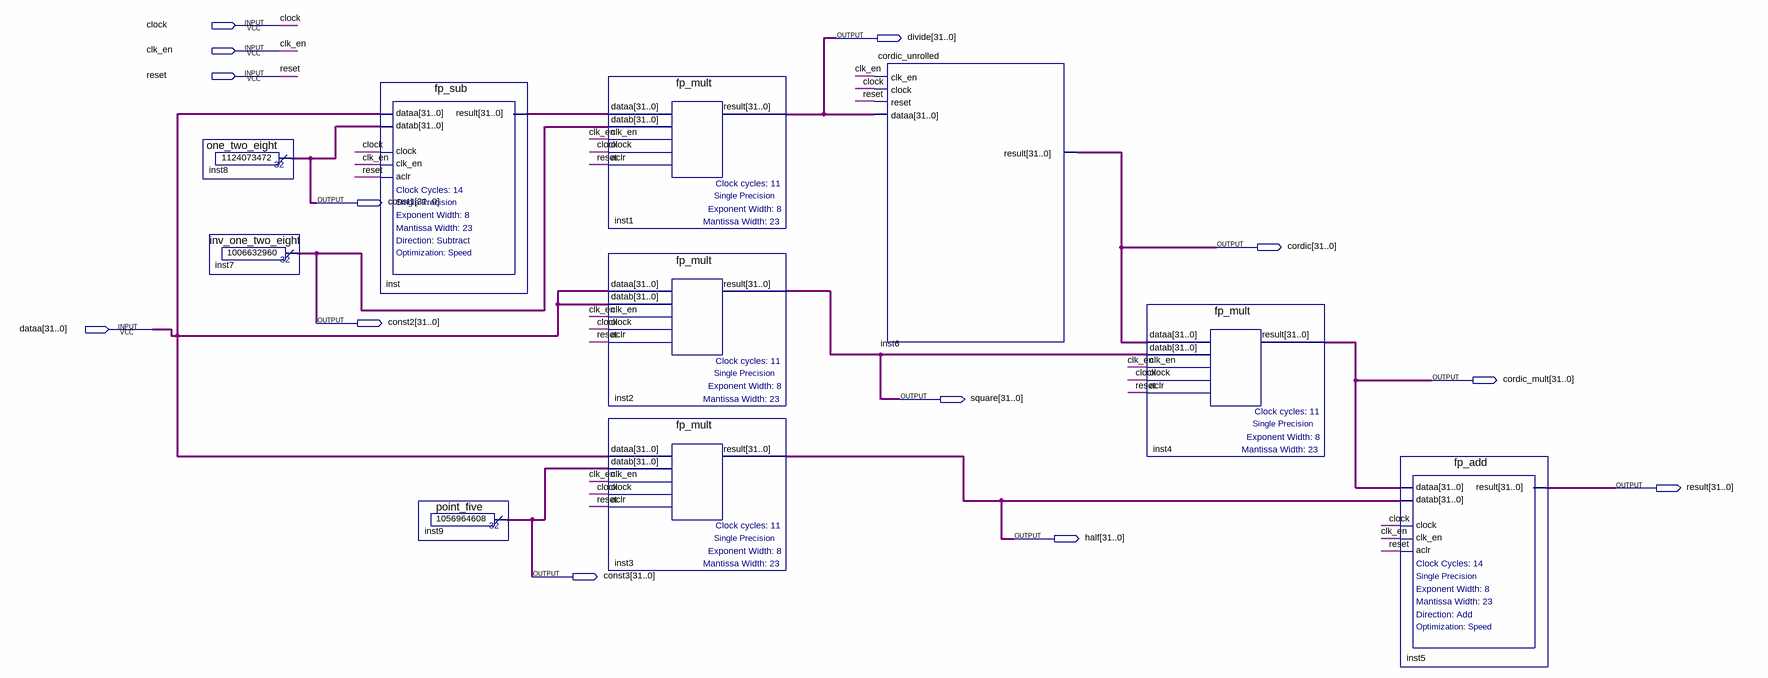
[diagram p0: schematic sheet]
// Quartus schematic full_function.bdf as structural Verilog: 10 symbols, 13 pins
module full_function (
  input  clock,
  input  clk_en,
  input  reset,
  input  [31:0] dataa,
  output [31:0] divide,
  output [31:0] const1,
  output [31:0] cordic,
  output [31:0] const2,
  output [31:0] cordic_mult,
  output [31:0] square,
  output [31:0] result,
  output [31:0] half,
  output [31:0] const3
);

  wire [31:0] inst_result;

  one_two_eight inst8 (.result(const1));
  inv_one_two_eight inst7 (.result(const2));
  fp_sub inst (.dataa(dataa), .datab(const1), .clock(clock), .clk_en(clk_en), .aclr(reset), .result(inst_result));
  point_five inst9 (.result(const3));
  fp_mult inst1 (.dataa(inst_result), .datab(const2), .clk_en(clk_en), .clock(clock), .aclr(reset), .result(divide));
  fp_mult inst2 (.dataa(dataa), .datab(dataa), .clk_en(clk_en), .clock(clock), .aclr(reset), .result(square));
  fp_mult inst3 (.dataa(dataa), .datab(const3), .clk_en(clk_en), .clock(clock), .aclr(reset), .result(half));
  cordic_unrolled inst6 (.clk_en(clk_en), .clock(clock), .reset(reset), .dataa(divide), .result(cordic));
  fp_mult inst4 (.dataa(cordic), .datab(square), .clk_en(clk_en), .clock(clock), .aclr(reset), .result(cordic_mult));
  fp_add inst5 (.dataa(cordic_mult), .datab(half), .clock(clock), .clk_en(clk_en), .aclr(reset), .result(result));
endmodule
